# Altium schematic sheet IO_Boardv3_RelayAlarm.SchDoc
size A3
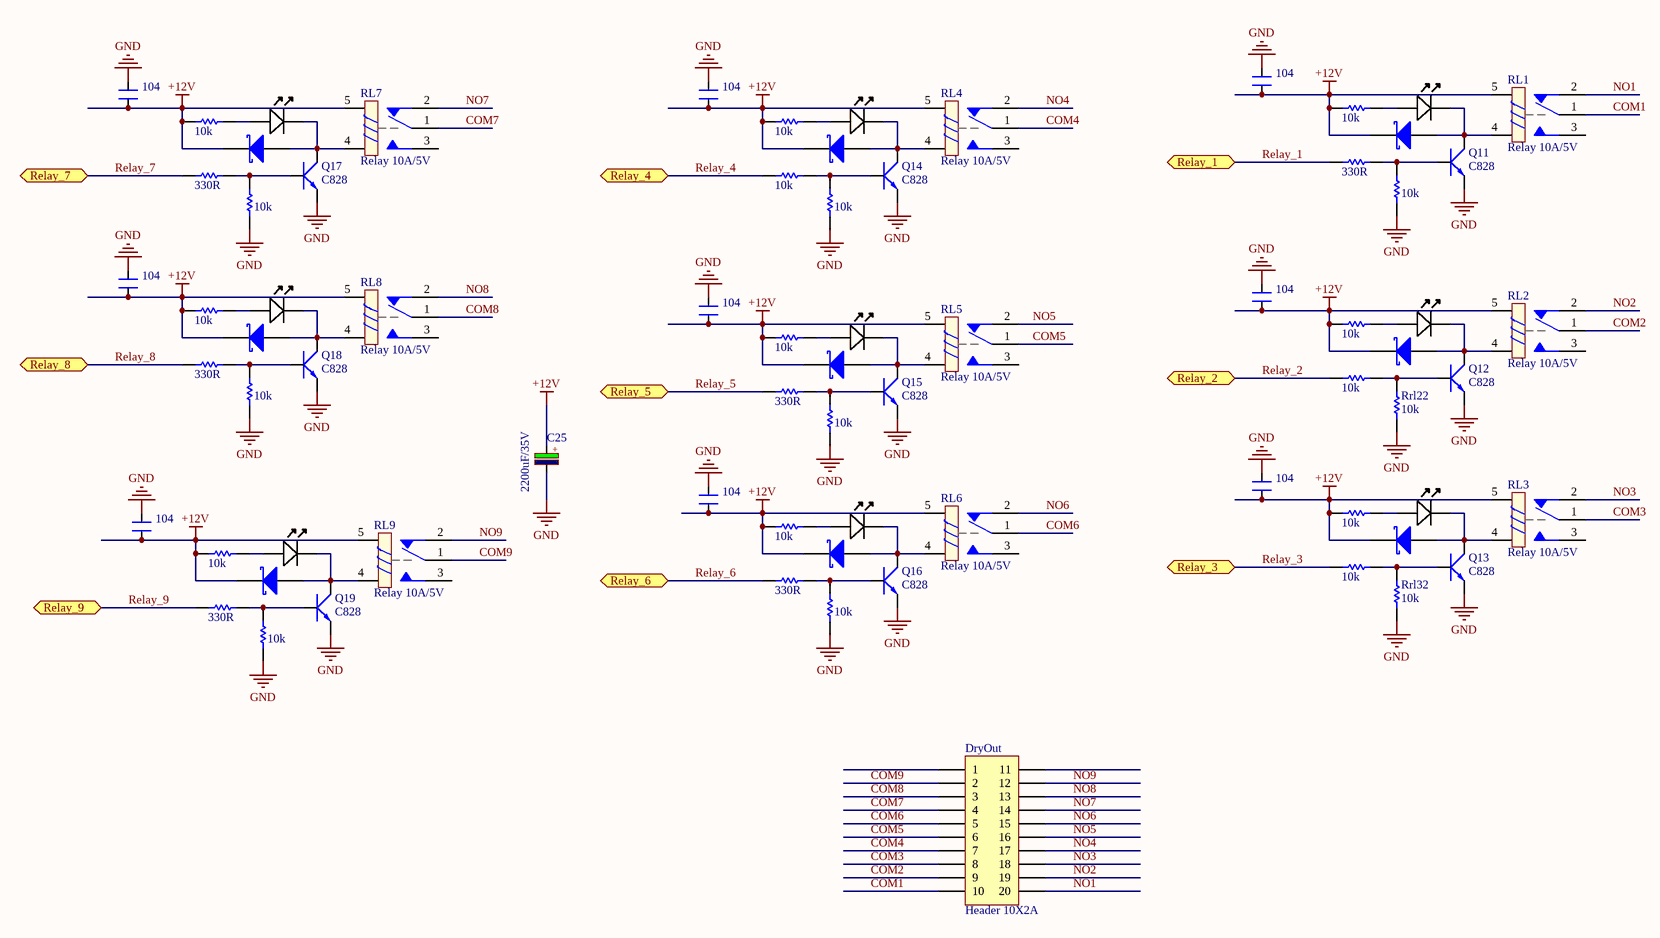
[diagram p0: IO_Boardv3_RelayAlarm.SchDoc]

## Parts
C25  2200uF/35V  [CP_1000uF_25V]
Crl1  value 104  [CAPC2012N_F]  (hidden comment: CAP NP)
Crl2  value 104  [CAPC2012N_F]  (hidden comment: CAP NP)
Crl3  value 104  [CAPC2012N_F]  (hidden comment: CAP NP)
Crl4  value 104  [CAPC2012N_F]  (hidden comment: CAP NP)
Crl5  value 104  [CAPC2012N_F]  (hidden comment: CAP NP)
Crl6  value 104  [CAPC2012N_F]  (hidden comment: CAP NP)
Crl7  value 104  [CAPC2012N_F]  (hidden comment: CAP NP)
Crl8  value 104  [CAPC2012N_F]  (hidden comment: CAP NP)
Crl9  value 104  [CAPC2012N_F]  (hidden comment: CAP NP)
D11  Diode  [DO-214AC]  (value not drawn)
D12  Diode  [DO-214AC]  (value not drawn)
D13  Diode  [DO-214AC]  (value not drawn)
D14  Diode  [DO-214AC]  (value not drawn)
D15  Diode  [DO-214AC]  (value not drawn)
D16  Diode  [DO-214AC]  (value not drawn)
D17  Diode  [DO-214AC]  (value not drawn)
D18  Diode  [DO-214AC]  (value not drawn)
D19  Diode  [DO-214AC]  (value not drawn)
DryOut  Header 10X2A  [HDR2X10_CEN]
E1  Blue  [LED-0805-A]  (value not drawn)
E2  Blue  [LED-0805-A]  (value not drawn)
E3  Blue  [LED-0805-A]  (value not drawn)
E4  Blue  [LED-0805-A]  (value not drawn)
E5  Blue  [LED-0805-A]  (value not drawn)
E6  Blue  [LED-0805-A]  (value not drawn)
E7  Blue  [LED-0805-A]  (value not drawn)
E8  Blue  [LED-0805-A]  (value not drawn)
E9  Blue  [LED-0805-A]  (value not drawn)
Q11  C828  [SOT23 TOP]
Q12  C828  [SOT23 TOP]
Q13  C828  [SOT23 TOP]
Q14  C828  [SOT23 TOP]
Q15  C828  [SOT23 TOP]
Q16  C828  [SOT23 TOP]
Q17  C828  [SOT23 TOP]
Q18  C828  [SOT23 TOP]
Q19  C828  [SOT23 TOP]
RL1  Relay 10A/5V  [RL_5PIN]
RL2  Relay 10A/5V  [RL_5PIN]
RL3  Relay 10A/5V  [RL_5PIN]
RL4  Relay 10A/5V  [RL_5PIN]
RL5  Relay 10A/5V  [RL_5PIN]
RL6  Relay 10A/5V  [RL_5PIN]
RL7  Relay 10A/5V  [RL_5PIN]
RL8  Relay 10A/5V  [RL_5PIN]
RL9  Relay 10A/5V  [RL_5PIN]
Rl52  value 10k  [RESC1608N_ZERO]  (hidden comment: Res)
Rrl11  value 330R  [RESC1608N_ZERO]  (hidden comment: Res)
Rrl12  value 10k  [RESC1608N_ZERO]  (hidden comment: Res)
Rrl13  value 10k  [RESC1608N_ZERO]  (hidden comment: Res)
Rrl21  value 10k  [RESC1608N_ZERO]  (hidden comment: Res)
Rrl22  value 10k  [RESC1608N_ZERO]  (hidden comment: Res)
Rrl23  value 10k  [RESC1608N_ZERO]  (hidden comment: Res)
Rrl31  value 10k  [RESC1608N_ZERO]  (hidden comment: Res)
Rrl32  value 10k  [RESC1608N_ZERO]  (hidden comment: Res)
Rrl33  value 10k  [RESC1608N_ZERO]  (hidden comment: Res)
Rrl41  value 10k  [RESC1608N_ZERO]  (hidden comment: Res)
Rrl42  value 10k  [RESC1608N_ZERO]  (hidden comment: Res)
Rrl43  value 10k  [RESC1608N_ZERO]  (hidden comment: Res)
Rrl51  value 330R  [RESC1608N_ZERO]  (hidden comment: Res)
Rrl53  value 10k  [RESC1608N_ZERO]  (hidden comment: Res)
Rrl61  value 330R  [RESC1608N_ZERO]  (hidden comment: Res)
Rrl62  value 10k  [RESC1608N_ZERO]  (hidden comment: Res)
Rrl63  value 10k  [RESC1608N_ZERO]  (hidden comment: Res)
Rrl71  value 330R  [RESC1608N_ZERO]  (hidden comment: Res)
Rrl72  value 10k  [RESC1608N_ZERO]  (hidden comment: Res)
Rrl73  value 10k  [RESC1608N_ZERO]  (hidden comment: Res)
Rrl81  value 330R  [RESC1608N_ZERO]  (hidden comment: Res)
Rrl82  value 10k  [RESC1608N_ZERO]  (hidden comment: Res)
Rrl83  value 10k  [RESC1608N_ZERO]  (hidden comment: Res)
Rrl91  value 330R  [RESC1608N_ZERO]  (hidden comment: Res)
Rrl92  value 10k  [RESC1608N_ZERO]  (hidden comment: Res)
Rrl93  value 10k  [RESC1608N_ZERO]  (hidden comment: Res)

## Ports
Relay_1, Relay_2, Relay_3, Relay_4, Relay_5, Relay_6, Relay_7, Relay_8, Relay_9

## Nets
+12V: C25.1 Crl1.1 Crl2.1 Crl3.1 Crl4.1 Crl5.1 Crl6.1 Crl7.1 Crl8.1 Crl9.1 D11.2(K) D12.2(K) D13.2(K) D14.2(K) D15.2(K) D16.2(K) D17.2(K) D18.2(K) D19.2(K) RL1.5 RL2.5 RL3.5 RL4.5 RL5.5 RL6.5 RL7.5 RL8.5 RL9.5 Rrl13.2 Rrl23.2 Rrl33.2 Rrl43.2 Rrl53.2 Rrl63.2 Rrl73.2 Rrl83.2 Rrl93.2
GND: C25.2 Crl1.2 Crl2.2 Crl3.2 Crl4.2 Crl5.2 Crl6.2 Crl7.2 Crl8.2 Crl9.2 Q11.3(E) Q12.3(E) Q13.3(E) Q14.3(E) Q15.3(E) Q16.3(E) Q17.3(E) Q18.3(E) Q19.3(E) Rl52.1 Rrl12.1 Rrl22.1 Rrl32.1 Rrl42.1 Rrl62.1 Rrl72.1 Rrl82.1 Rrl92.1
COM1: DryOut.10 RL1.1
COM2: DryOut.9 RL2.1
COM3: DryOut.8 RL3.1
COM4: DryOut.7 RL4.1
COM5: DryOut.6 RL5.1
COM6: DryOut.5 RL6.1
COM7: DryOut.4 RL7.1
COM8: DryOut.3 RL8.1
COM9: DryOut.2 RL9.1
NO1: DryOut.20 RL1.2
NO2: DryOut.19 RL2.2
NO3: DryOut.18 RL3.2
NO4: DryOut.17 RL4.2
NO5: DryOut.16 RL5.2
NO6: DryOut.15 RL6.2
NO7: DryOut.14 RL7.2
NO8: DryOut.13 RL8.2
NO9: DryOut.12 RL9.2
Relay_1: Rrl11.1 ; port Relay_1
Relay_2: Rrl21.1 ; port Relay_2
Relay_3: Rrl31.1 ; port Relay_3
Relay_4: Rrl41.1 ; port Relay_4
Relay_5: Rrl51.1 ; port Relay_5
Relay_6: Rrl61.1 ; port Relay_6
Relay_7: Rrl71.1 ; port Relay_7
Relay_8: Rrl81.1 ; port Relay_8
Relay_9: Rrl91.1 ; port Relay_9
NetD11_1: D11.1(A) E1.K Q11.2(C) RL1.4
NetD12_1: D12.1(A) E2.K Q12.2(C) RL2.4
NetD13_1: D13.1(A) E3.K Q13.2(C) RL3.4
NetD14_1: D14.1(A) E4.K Q14.2(C) RL4.4
NetD15_1: D15.1(A) E5.K Q15.2(C) RL5.4
NetD16_1: D16.1(A) E6.K Q16.2(C) RL6.4
NetD17_1: D17.1(A) E7.K Q17.2(C) RL7.4
NetD18_1: D18.1(A) E8.K Q18.2(C) RL8.4
NetD19_1: D19.1(A) E9.K Q19.2(C) RL9.4
NetE1_A: E1.A Rrl13.1
NetE2_A: E2.A Rrl23.1
NetE3_A: E3.A Rrl33.1
NetE4_A: E4.A Rrl43.1
NetE5_A: E5.A Rrl53.1
NetE6_A: E6.A Rrl63.1
NetE7_A: E7.A Rrl73.1
NetE8_A: E8.A Rrl83.1
NetE9_A: E9.A Rrl93.1
NetQ11_1: Q11.1(B) Rrl11.2 Rrl12.2
NetQ12_1: Q12.1(B) Rrl21.2 Rrl22.2
NetQ13_1: Q13.1(B) Rrl31.2 Rrl32.2
NetQ14_1: Q14.1(B) Rrl41.2 Rrl42.2
NetQ15_1: Q15.1(B) Rl52.2 Rrl51.2
NetQ16_1: Q16.1(B) Rrl61.2 Rrl62.2
NetQ17_1: Q17.1(B) Rrl71.2 Rrl72.2
NetQ18_1: Q18.1(B) Rrl81.2 Rrl82.2
NetQ19_1: Q19.1(B) Rrl91.2 Rrl92.2

Not connected (* = marked no-connect by the designer): DryOut 1 11; RL1 3; RL2 3; RL3 3; RL4 3; RL5 3; RL6 3; RL7 3; RL8 3; RL9 3

## Notes on the sheet
- (in symbol CP4) +

## Library data of the parts
C25 = CP4: Cap 1000uF/16V - 220uF/50V; Description 5: 4,7uF>10uF/250V_3,3uF>10uF/400V - 2,2uF>4,7uF/450V; Description 1: 2200uF-3300uF/6,3V - 1000uF-2200uF/10V; Description 2: 1000uF/16V - 470uF => 1000uF/25V - 100uF/100V; Description 3: 330uF>470uF/35V_220uF>470uF/50V_10uF>22uF/250V; Description 4: 220uF => 330uF/63V - 10uF =>33uF/160 - 200V; Value: 1000uF/16V
D11-D19 = Diode: pin to pad: 1>A 2>K
DryOut = Header 10X2A: Header, 10-Pin, Dual row; LatestRevisionDate: 17-Jul-2002; LatestRevisionNote: Re-released for DXP Platform.; Publisher: Altium Limited
E1-E9 = LED_SMD_Blue_0805_100mcd: LED 0805 SMD Blue 100mcd 470nm; Manufacturer 1: Ligitek; Manufacturer Part Number 1: LG-170DBKZ-CT; Ratings: 100 mcd; 470 nm; Package / Case: 0805; Material: InGaN/GaN; Value: Blue; Color: Blue
Q11-Q19 = NPN: Transistor C828 C1815....
RL1-RL9 = Relay 1: Relay SPDT,10A - 12VDC 5 Pin; Value: Relay SPDT, 10A, 12V